# Altium schematic sheet Microcontroller.SchDoc
size A4; SheetNumber: 2; SheetTotal: 5
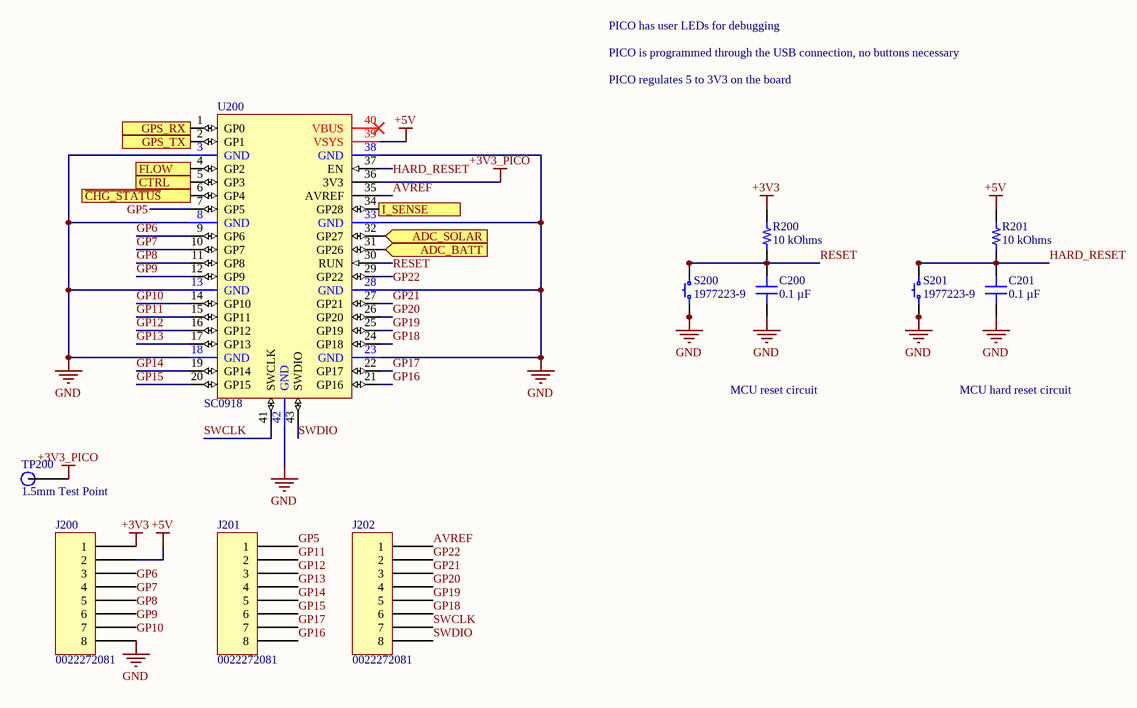
[diagram p0: Microcontroller.SchDoc]

## Parts
C200  0.1 µF  [CAP 0603_1608]
C201  0.1 µF  [CAP 0603_1608]
J200  0022272081  [MOLEX KK 0022272081]
J201  0022272081  [MOLEX KK 0022272081]
J202  0022272081  [MOLEX KK 0022272081]
R200  10 kOhms  [RES 0603_1608]
R201  10 kOhms  [RES 0603_1608]
S200  1977223-9  [TE FSM4JSMA]
S201  1977223-9  [TE FSM4JSMA]
TP200  1.5mm Test Point  [1mm Test Point-Footprint-1]
U200  SC0918  [New footprint 1]

## Ports
ADC_BATT (in), ADC_SOLAR (in), CTRL (out), FLOW (in), GPS_RX (out), GPS_TX (in), I_SENSE (in), ~{CHG_STATUS} (in)

## Nets
+3V3: J200.1 R200.2
+3V3_PICO: TP200.1 U200.36(3V3)
+5V: J200.2 R201.2 U200.39(VSYS)
GND: C200.1 C201.1 J200.8 S200.1 S200.2 S201.1 S201.2 U200.3(GND) U200.8(GND) U200.13(GND) U200.18(GND) U200.23(GND) U200.28(GND) U200.33(GND) U200.38(GND) U200.42(GND)
~{CHG_STATUS}: U200.6(GP4) ; port ~{CHG_STATUS}
ADC_BATT: U200.31(GP26) ; port ADC_BATT
ADC_SOLAR: U200.32(GP27) ; port ADC_SOLAR
AVREF: J202.1 U200.35(AVREF)
CTRL: U200.5(GP3) ; port CTRL
FLOW: U200.4(GP2) ; port FLOW
GP5: J201.1 U200.7(GP5)
GP6: J200.3 U200.9(GP6)
GP7: J200.4 U200.10(GP7)
GP8: J200.5 U200.11(GP8)
GP9: J200.6 U200.12(GP9)
GP10: J200.7 U200.14(GP10)
GP11: J201.2 U200.15(GP11)
GP12: J201.3 U200.16(GP12)
GP13: J201.4 U200.17(GP13)
GP14: J201.5 U200.19(GP14)
GP15: J201.6 U200.20(GP15)
GP16: J201.8 U200.21(GP16)
GP17: J201.7 U200.22(GP17)
GP18: J202.6 U200.24(GP18)
GP19: J202.5 U200.25(GP19)
GP20: J202.4 U200.26(GP20)
GP21: J202.3 U200.27(GP21)
GP22: J202.2 U200.29(GP22)
GPS_RX: U200.1(GP0) ; port GPS_RX
GPS_TX: U200.2(GP1) ; port GPS_TX
HARD_RESET: C201.2 R201.1 S201.3 S201.4 U200.37(EN)
I_SENSE: U200.34(GP28) ; port I_SENSE
RESET: C200.2 R200.1 S200.3 S200.4 U200.30(RUN)
SWCLK: J202.7 U200.41(SWCLK)
SWDIO: J202.8 U200.43(SWDIO)

Not connected (* = marked no-connect by the designer): U200 40(VBUS)*

## Notes on the sheet
- PICO has user LEDs for debugging
- PICO is programmed through the USB connection, no buttons necessary
- PICO regulates 5 to 3V3 on the board
- MCU reset circuit
- MCU hard reset circuit

## Library data of the parts
C200 C201 = C0603X104M3RAC7867: CAP CER 0.1UF 25V X7R 0603; manufacturer: KEMET; Tolerance: ±20%; Part Number: C0603X104M3RAC7867; Value: 0.1 µF; Applications: Boardflex Sensitive; Capacitance: 0.1 µF; componentlink1description: Datasheet; componentlink1url: https://api.kemet.com/component-edge/download/datasheet/C0603X104M3RACTU.pdf; componentlink2description: DigiKey Link; componentlink2url: https://www.digikey.com/en/products/detail/kemet/C0603X104M3RAC7867/2202613; Device Package: 0603 (1608 Metric); Features: Soft Termination; lastupdated: 2022-03-07 3:18:24 PM; Lifecycle Status: Active; Minimum Order: 1; Mounting Type: Surface Mount, MLCC; Operating Temperature: -55°C ~ 125°C; Package / Case: 0603 (1608 Metric); packaging: TapeAndReel; partid: 2484; Part Status: Active; price: 0.07; series: SMD Comm X7R Flex; Size / Dimension: 0.063" L x 0.031" W (1.60mm x 0.80mm); Supplier 1: DigiKey; Supplier Part Number 1: 399-13148-1-ND; Temperature Coefficient: X7R; Thickness (Max): 0.034" (0.87mm); Voltage - Rated: 25V
J200-J202 = 0022272081: CONN HEADER VERT 8POS 2.54MM; Manufacturer: Molex; Contact Length - Mating: 0.295" (7.49mm); Contact Length - Post: 0.140" (3.56mm); Material Flammability Rating: UL94 V-0; Number of Positions: 8; Number of Positions Loaded: All; Overall Contact Length: 0.560" (14.22mm); Pitch - Mating: 0.100" (2.54mm); Shrouding: Shrouded - 1 Wall; Style: Board to Cable/Wire; Part Number: 0022272081; ComponentLink1Description: Datasheet; ComponentLink1URL: https://www.molex.com/pdm_docs/sd/022272081_sd.pdf; ComponentLink2Description: DigiKey Link; ComponentLink2URL: http://digikey.com/product-detail/en/molex/0022272081/WM4117-ND/1130583; Connector Type: Header; Contact Finish - Mating: Tin; Contact Finish - Post: Tin; Contact Finish Thickness - Mating: 100.0µin (2.54µm); Contact Material: Brass; Contact Shape: Square; Contact Type: Male Pin; Fastening Type: Friction Lock; Insulation Color: Natural; Insulation Height: 0.461" (11.70mm); Insulation Material: Polyamide (PA), Nylon; LastUpdated: 2020-01-12 11:52:41 PM; Lifecycle Status: Active; Minimum Order: 1; Mounting Type: Through Hole; Number of Rows: 1; Packaging: Bulk; PartId: 82; Part Status: Active; Price: 0.60; Series: KK 6410; Supplier 1: DigiKey; Supplier Part Number 1: WM4117-ND; Termination: Solder
R200 R201 = RT0603FRE0710KL: RES SMD 10K OHM 1% 1/10W 0603; Manufacturer: Yageo; Power (Watts): 0.1W, 1/10W; Temperature Coefficient: ±50ppm/°C; Part Number: RT0603FRE0710KL; Value: 10 kOhms; ComponentLink1Description: Datasheet; ComponentLink1URL: https://www.yageo.com/upload/media/product/productsearch/datasheet/rchip/PYu-RT_1-to-0.01_RoHS_L_11.pdf; ComponentLink2Description: DigiKey Link; ComponentLink2URL: http://digikey.com/product-detail/en/yageo/RT0603FRE0710KL/YAG2321CT-ND/5252435; Composition: Thin Film; Device Package: 0603 (1608 Metric); Height - Seated (Max): 0.022" (0.55mm); LastUpdated: 2022-03-07 3:35:56 PM; Lifecycle Status: Active; Minimum Order: 1; Number of Terminations: 2; Operating Temperature: -55°C ~ 155°C; Package / Case: 0603 (1608 Metric); Packaging: TapeAndReel; PartId: 5671; Part Status: Active; Price: 0.01; Resistance: 10 kOhms; Series: RT; Size / Dimension: 0.063" L x 0.031" W (1.60mm x 0.80mm); Supplier 1: DigiKey; Supplier Part Number 1: YAG2321CT-ND; Supplier Device Package: 0603; Tolerance: ±1%
S200 S201 = 1977223-9: SWITCH TACTILE SPST-NO 0.05A 24V; Manufacturer: TE Connectivity ALCOSWITCH Switches; Actuator Height off PCB, Vertical: 5.00mm; Actuator Orientation: Top Actuated; Actuator Type: Standard; Contact Rating @ Voltage: 0.05A @ 24VDC; Illumination: Non-Illuminated; Operating Force: 160gf; Outline: 6.00mm x 6.00mm; Switch Function: Off-Mom; Part Number: 1977223-9; Circuit: SPST-NO; ComponentLink1Description: Datasheet; ComponentLink1URL: https://www.te.com/commerce/DocumentDelivery/DDEController?Action=srchrtrv&DocNm=1308111-1_SWITCHES_CORE_PROGRAM_CATALOG&DocType=CS&DocLang=English; ComponentLink2Description: DigiKey Link; ComponentLink2URL: http://digikey.com/product-detail/en/te-connectivity-alcoswitch-switches/1977223-9/1977223-9-ND/5597033; LastUpdated: 2020-08-30 9:06:45 PM; Lifecycle Status: Active; Minimum Order: 30000; Mounting Type: Surface Mount; Packaging: Bulk; Price: 0.16; Series: FSMJSMA; Supplier 1: DigiKey; Supplier Part Number 1: 1977223-9-ND; Termination Style: Gull Wing
TP200 = CMP-002-00006-1: 1.5mm Test Point 0.75mm hole size
U200 = CMP-00055-1: Raspberry Pi Pico W